# EAGLE design kalicki3v3 (EAGLE 6.3)
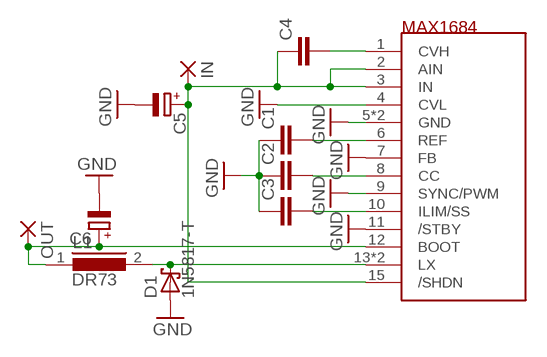
[diagram p0: schematic, sheet 1]

## Parts
C1  C-EUC0805  [C0805]
C2  C-EUC0805  [C0805]
C3  C-EUC0805  [C0805]
C4  C-EUC0805  [C0805]
C5  CPOL-EUE2.5-7  [E2,5-7]
C6  CPOL-EUE2.5-7  [E2,5-7]
D1  1N5817-T  [DO41-7.6]
IN  2,54/0,8  [2,54/0,8]
L1  DR73  [DR73]
OUT  2,54/0,8  [2,54/0,8]
U$1  MAX1684  [QSOP16]

## Nets
GND: C1.1 C2.1 C3.1 C5.- C6.- D1.A U$1.4(CVL) U$1.5(GND) U$1.7(FB) U$1.9(SYNC/PWM) U$1.11(/STBY) U$1.16(GND)
N$1: C4.1 C5.+ IN.1(P) U$1.2(AIN) U$1.3(IN) U$1.15(/SHDN)
N$2: C3.2 U$1.10(ILIM/SS)
N$3: C2.2 U$1.8(CC)
N$4: C1.2 U$1.6(REF)
N$5: C4.2 U$1.1(CVH)
N$7: D1.C L1.2 U$1.13(LX) U$1.14(LX)
N$8: C6.+ L1.1 OUT.1(P) U$1.12(BOOT)

## Library data of the parts
C1-C4 = rcl:C-EU: CAPACITOR, European symbol
C5 C6 = rcl:CPOL-EU: POLARIZED CAPACITOR, European symbol
D1 = diode:1N581*: 1.0A SCHOTTKY BARRIER RECTIFIER Source: http://www.diodes.com/datasheets/ds23001.pdf
IN OUT = wirepad:2,54/0,8: THROUGH-HOLE PAD
L1 = inductors:DR73: High Power Density, High Efficiency, Shielded Inductors Source: coiltronics_dr_series.pdf
U$1 = ref-packages:MAX1684

## Board
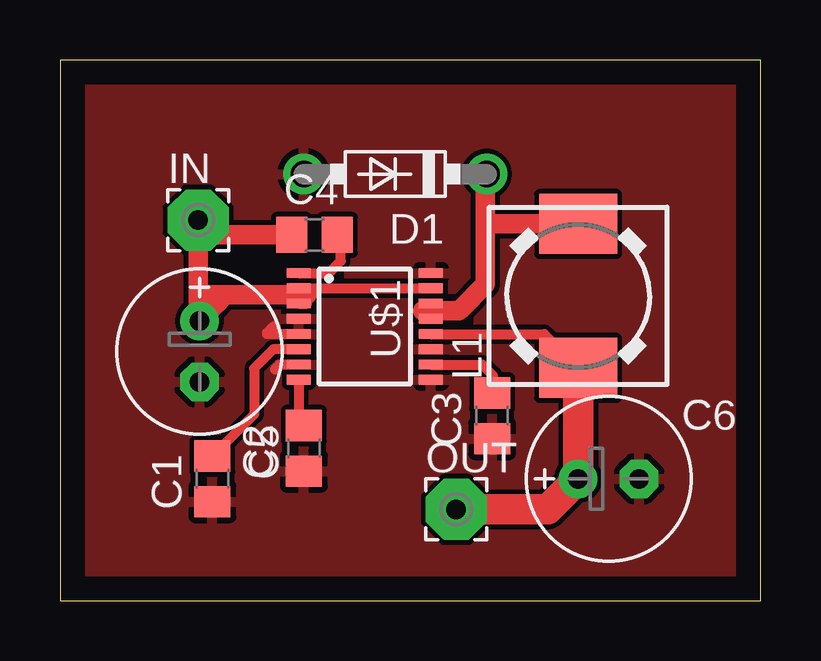
[diagram p1: board, top side]

Size 29.19 x 22.53 mm. Coordinates in mm from the lower left corner, seen from the top.
Outline: 0,0 29.19,0 29.19,22.53 0,22.53 0,0
Copper layers (1*16): Top 0.035mm / dielectric 1.5mm / Bottom 0.035mm
Design rules "default": minimum track width 10mil, minimum drill 24mil, track to track 8mil, track to pad 8mil, pad to pad 8mil, via to via 8mil, smd to smd 8mil, copper to edge 40mil, drill to drill 8mil, minimum pad ring 10mil, minimum via ring 8mil, stop-mask expansion 4mil, vias tented up to drill 0mil, thermal gap 10mil

### Footprints (pad centres in the part's own frame; a part is rotated, then mirrored left to right if it is on the bottom)
C0805 = smd 1.3 x 1.5: 1 -0.95,0; 2 0.95,0
E2,5-7 = drill 0.813 pad 1.6: + -1.27,0 | drill 0.813 pad 1.6 octagon: - 1.27,0
DO41-7.6 = drill 1.1 pad 1.7: A 3.81,0; C -3.81,0
2,54/0,8 = drill 0.813 pad 2.54 octagon: 1 0,0
DR73 = smd 2.5 x 3.25: 1 -3,0; 2 3,0
QSOP16 = smd 0.4 x 1: 1 -2.223,-2.75; 2 -1.588,-2.75; 3 -0.953,-2.75; 4 -0.318,-2.75; 5 0.318,-2.75; 6 0.953,-2.75; 7 1.588,-2.75; 8 2.223,-2.75; 9 2.223,2.75; 10 1.588,2.75; 11 0.953,2.75; 12 0.318,2.75; 13 -0.318,2.75; 14 -0.953,2.75; 15 -1.588,2.75; 16 -2.223,2.75

### Placement (x,y rotation side)
C1  6.35,5.08 90 top
C2  10.16,6.35 90 top
C3  18,7.7 90 top
C4  10.6,15.24 0 top
C5  5.81,10.39 270 top
C6  22.86,5.08 0 top
D1  13.97,17.78 180 top
IN  5.76,15.86 0 top
L1  21.59,12.7 90 top
OUT  16.51,3.81 0 top
U$1  12.7,11.43 270 top

### Tracks (layer width: path | path; a pad name or v marks a point on that pad's centre or on a via)
GND
  Top 0.406: U$1.7 9.16,9.84 8.96,9.64 | U$1.5 8.64,11.11 8.63,11.1 8.63,11.17 8.89,11.43
  pour Top: -2.54,-6.35 44.45,-6.35 44.45,36.83 -5.08,36.83 -5.08,-1.27
N$1
  Top 0.406: U$1.15 U$1.2 U$1.3 10.29,12.38 10.29,12.75 | 6.2,12.75 6.79,12.63 | 5.76,11.71 C5.+ | 5.9,15.24 5.76,15.1
  Top 0.813: 10.29,12.75 6.2,12.75 | 6.79,12.63 6.54,12.38 C5.+ | IN.1 5.76,15.1 5.76,11.71 | C4.1 5.9,15.24
N$2
  Top 0.406: U$1.10 17.58,9.84 18.03,9.4 18.03,8.68 C3.2
N$3
  Top 0.406: U$1.8 9.95,7.51 C2.2
N$4
  Top 0.406: U$1.6 8.88,10.48 8.08,9.68 8.08,7.76 C1.2
N$5
  Top 0.406: U$1.1 11.2,13.65 11.71,14.16 11.71,15.09 C4.2
N$7
  Top 0.406: U$1.13 U$1.14 15.12,12.38 15.12,12.08 | 16.62,12.08 16.62,12.11 16.67,12.12 | 17.71,17.71 D1.C | 18.05,15.7 17.71,16.04
  Top 0.813: 15.12,12.08 16.62,12.08 | 16.67,12.12 17.71,13.18 17.71,16.04 17.71,17.71 | L1.2 18.05,15.7
N$8
  Top 0.406: U$1.12 20.18,11.11 L1.1
  Top 1.27: L1.1 C6.+ 20.32,3.81 OUT.1